# EAGLE schematic ultimatedrive1 (EAGLE 9.6.0)
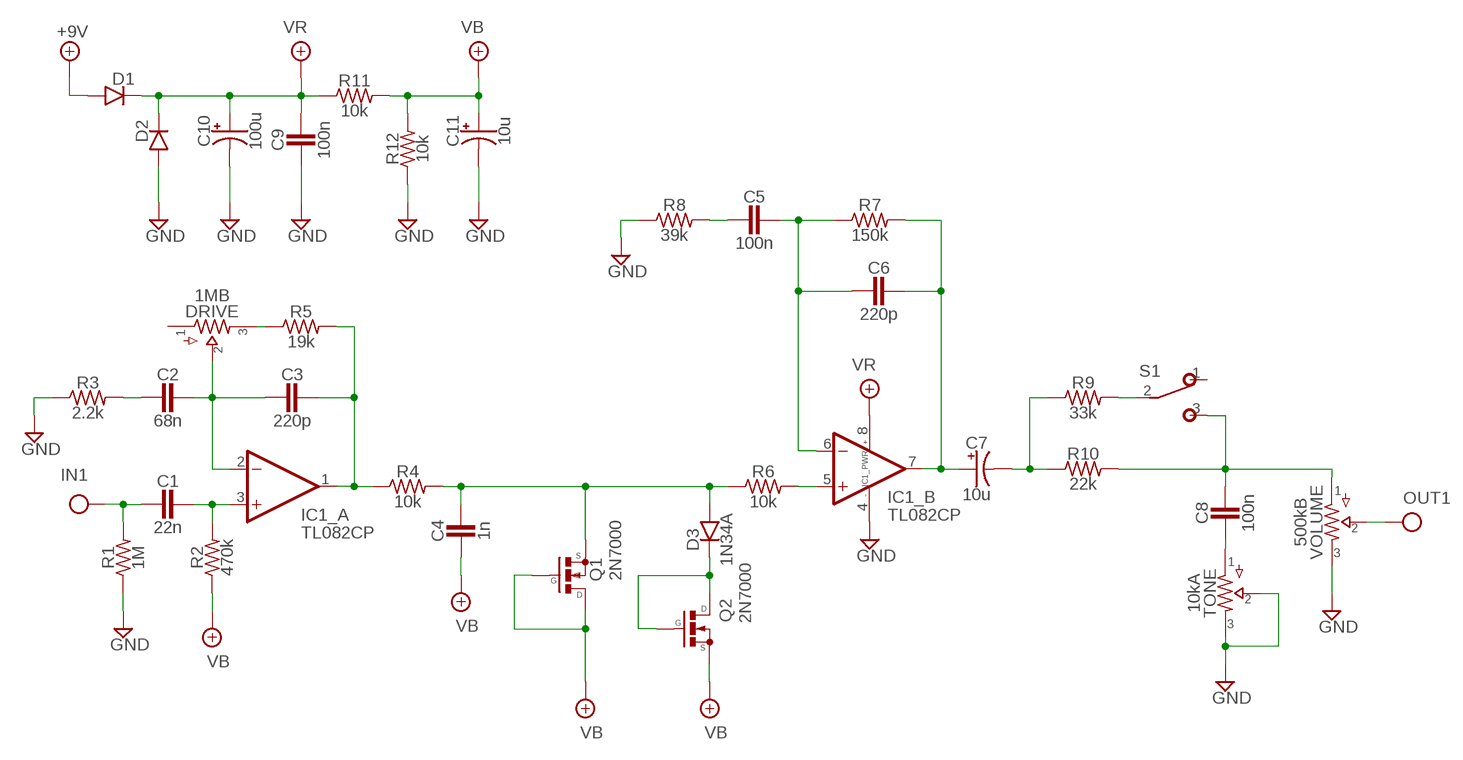
[diagram p0: schematic, sheet 1]

## Parts
C1  22n  CER/FILMBOX.1  [BOX_SMALL]
C2  68n  CER/FILMBOX.1  [BOX_SMALL]
C3  220p  CER/FILMBOX.1  [BOX_SMALL]
C4  1n  CER/FILMBOX.1  [BOX_SMALL]
C5  100n  CER/FILMBOX.1  [BOX_SMALL]
C6  220p  CER/FILMBOX.1  [BOX_SMALL]
C7  10u  0500  [050_020]
C8  100n  CER/FILMBOX.1  [BOX_SMALL]
C9  100n  CER/FILMBOX.1  [BOX_SMALL]
C10  100u  0500  [050_020]
C11  10u  0500  [050_020]
D1  DO41.3  [DO41-3]
D2  DO41.3  [DO41-3]
D3  1N34A  DO41.2  [DO41-2]
DRIVE  1MB  POTS16MM  [16MM]
IC1  TL082CP  DUALTH  [DIL0]
Q1  2N7000  [TO92-]
Q2  2N7000  [TO92-]
R1  1M  R_.3B  [R0207/3]
R2  470k  R_.3B  [R0207/3]
R3  2.2k  R_.3B  [R0207/3]
R4  10k  R_.3B  [R0207/3]
R5  19k  R_.3B  [R0207/3]
R6  10k  R_.3B  [R0207/3]
R7  150k  R_.3B  [R0207/3]
R8  39k  R_.3B  [R0207/3]
R9  33k  R_.3B  [R0207/3]
R10  22k  R_.3B  [R0207/3]
R11  10k  R_.3B  [R0207/3]
R12  10k  R_.3B  [R0207/3]
S1  SPDT  [M9040P]
TONE  10kA  POTS16MM  [16MM]
VOLUME  500kB  POTS16MM  [16MM]

## Nets
+9V: D1.A
GND: C9.2 C10.- C11.- D2.A IC1.4(_PWR:V-) R1.1 R3.1 R8.1 R12.1 TONE.2 TONE.3 VOLUME.3
IN: C1.2 R1.2
N$1: C7.- R9.1 R10.1
N$2: C8.2 TONE.1
N$4: C1.1 IC1.3(_A:+IN) R2.2
N$5: C2.1 C3.2 DRIVE.2 IC1.2(_A:-IN)
N$6: DRIVE.3 R5.1
N$7: C3.1 IC1.1(_A:OUT) R4.1 R5.2
N$8: C2.2 R3.2
N$9: IC1.5(_B:+IN) R6.2
N$10: D3.C Q2.1(D) Q2.2(G)
N$11: C4.1 D3.A Q1.3(S) R4.2 R6.1
N$12: C5.1 C6.2 IC1.6(_B:-IN) R7.1
N$13: C6.1 C7.+ IC1.7(_B:OUT) R7.2
N$14: C5.2 R8.2
N$15: R9.2 S1.2(P)
N$16: C8.1 R10.2 S1.3(S) VOLUME.1
OUT: VOLUME.2
VB: C4.2 C11.+ Q1.1(D) Q1.2(G) Q2.3(S) R2.1 R11.2 R12.2
VR: C9.1 C10.+ D1.C D2.C IC1.8(_PWR:V+) R11.1
Unconnected: DRIVE.1 S1.1(O)

## Library data of the parts
C1-C6 C8 C9 = pedals-capacitors-film:CER/FILM: 47 - 120pF Xicon Ceramic Disc 2.5mm lead spacing
C7 C10 C11 = pedals-capacitors-elec:050
D1-D3 = pedals-diodes:DO41: DO-41 Package Diodes: 1N4001 - 1N40019 Zener Diodes: 1N4728 - 1N4764
DRIVE TONE VOLUME = pedals-potentiometers:POTS
IC1 = pedals-integrated circuits:DUAL: OP AMP
Q1 Q2 = pedals-transistors:2N7000
R1-R12 = pedals-resistors:R_
S1 = pedals-switches:SPDT: TOGGLE SWITCH Marquardt